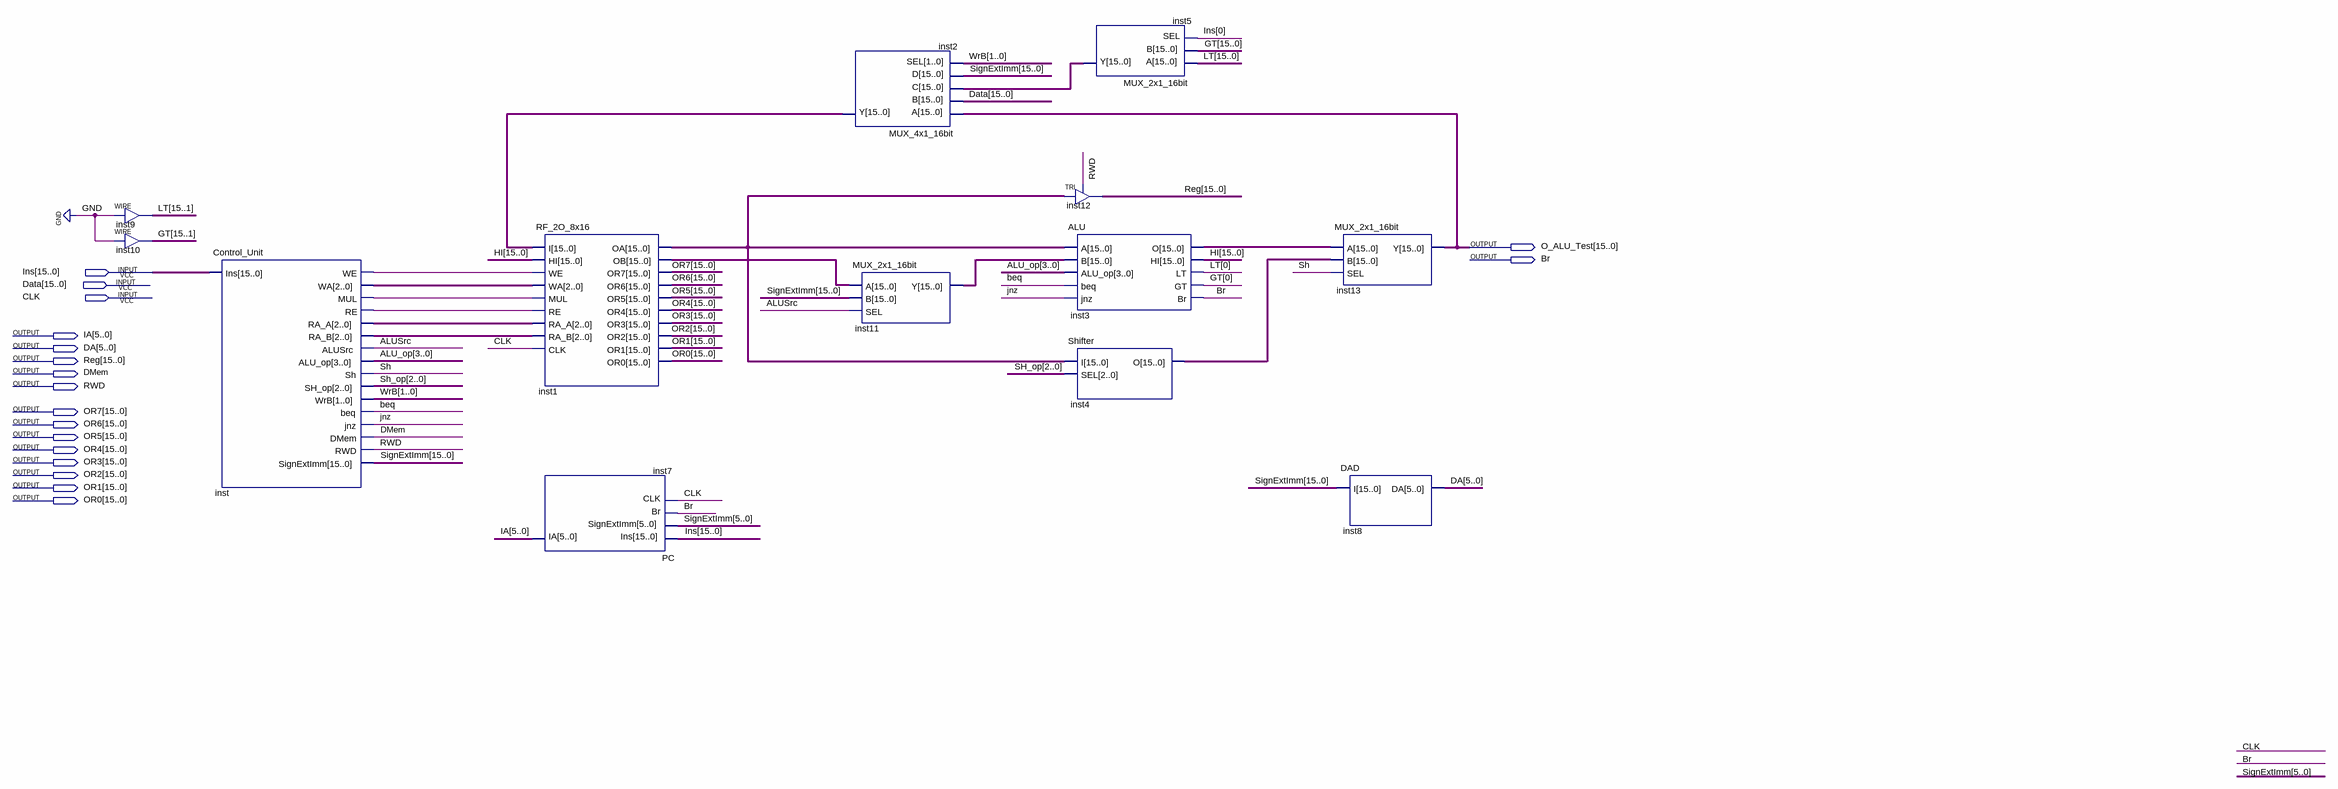
[diagram p0: schematic sheet]
// Quartus schematic CPU_16bit.bdf as structural Verilog: 13 symbols, 18 pins
module CPU_16bit (
  input  [15:0] Ins,
  input  [15:0] Data,
  input  CLK,
  output [15:0] O_ALU_Test,
  output Br,
  output [5:0] IA,
  output [5:0] DA,
  output [15:0] Reg,
  output DMem,
  output RWD,
  output [15:0] OR7,
  output [15:0] OR6,
  output [15:0] OR5,
  output [15:0] OR4,
  output [15:0] OR3,
  output [15:0] OR2,
  output [15:0] OR1,
  output [15:0] OR0
);

  wire ALUSrc, beq, inst_mul, inst_re, inst_we, jnz, Sh;
  wire [1:0] WrB;
  wire [2:0] inst_ra_a, inst_ra_b, inst_wa, SH_op;
  wire [3:0] ALU_op;
  wire [15:0] GT, HI, inst1_oa, inst1_ob, inst2_y, inst3_o, inst4_o, inst5_y, inst11_y, LT, SignExtImm;

  assign LT[15:1] = {15{1'b0}};  // WIRE inst9
  assign GT[15:1] = {15{1'b0}};  // WIRE inst10
  Control_Unit inst (
    .Ins(Ins), .WE(inst_we), .WA(inst_wa), .MUL(inst_mul), .RE(inst_re), .RA_A(inst_ra_a), .RA_B(inst_ra_b),
    .ALUSrc(ALUSrc), .ALU_op(ALU_op), .Sh(Sh), .SH_op(SH_op), .WrB(WrB), .beq(beq), .jnz(jnz), .DMem(DMem),
    .RWD(RWD), .SignExtImm(SignExtImm));
  RF_2O_8x16 inst1 (
    .I(inst2_y), .HI(HI), .WE(inst_we), .WA(inst_wa), .MUL(inst_mul), .RE(inst_re), .RA_A(inst_ra_a),
    .RA_B(inst_ra_b), .CLK(CLK), .OA(inst1_oa), .OB(inst1_ob), .OR7(OR7), .OR6(OR6), .OR5(OR5), .OR4(OR4),
    .OR3(OR3), .OR2(OR2), .OR1(OR1), .OR0(OR0));
  PC inst7 (.Ins(Ins), .SignExtImm(SignExtImm[5:0]), .Br(Br), .CLK(CLK), .IA(IA));
  MUX_4x1_16bit inst2 (.A(O_ALU_Test), .B(Data), .C(inst5_y), .D(SignExtImm), .SEL(WrB), .Y(inst2_y));
  MUX_2x1_16bit inst11 (.A(inst1_ob), .B(SignExtImm), .SEL(ALUSrc), .Y(inst11_y));
  MUX_2x1_16bit inst5 (.A(LT), .B(GT), .SEL(Ins[0]), .Y(inst5_y));
  TRI inst12[15:0] (.IN(inst1_oa), .OE(RWD), .OUT(Reg));
  ALU inst3 (
    .A(inst1_oa), .B(inst11_y), .ALU_op(ALU_op), .beq(beq), .jnz(jnz), .O(inst3_o), .HI(HI), .LT(LT[0]),
    .GT(GT[0]), .Br(Br));
  Shifter inst4 (.I(inst1_oa), .SEL(SH_op), .O(inst4_o));
  MUX_2x1_16bit inst13 (.A(inst3_o), .B(inst4_o), .SEL(Sh), .Y(O_ALU_Test));
  DAD inst8 (.I(SignExtImm), .DA(DA));
endmodule
